# EasyEDA schematic SCH_Smart_Dispenser_2024-07-08.json
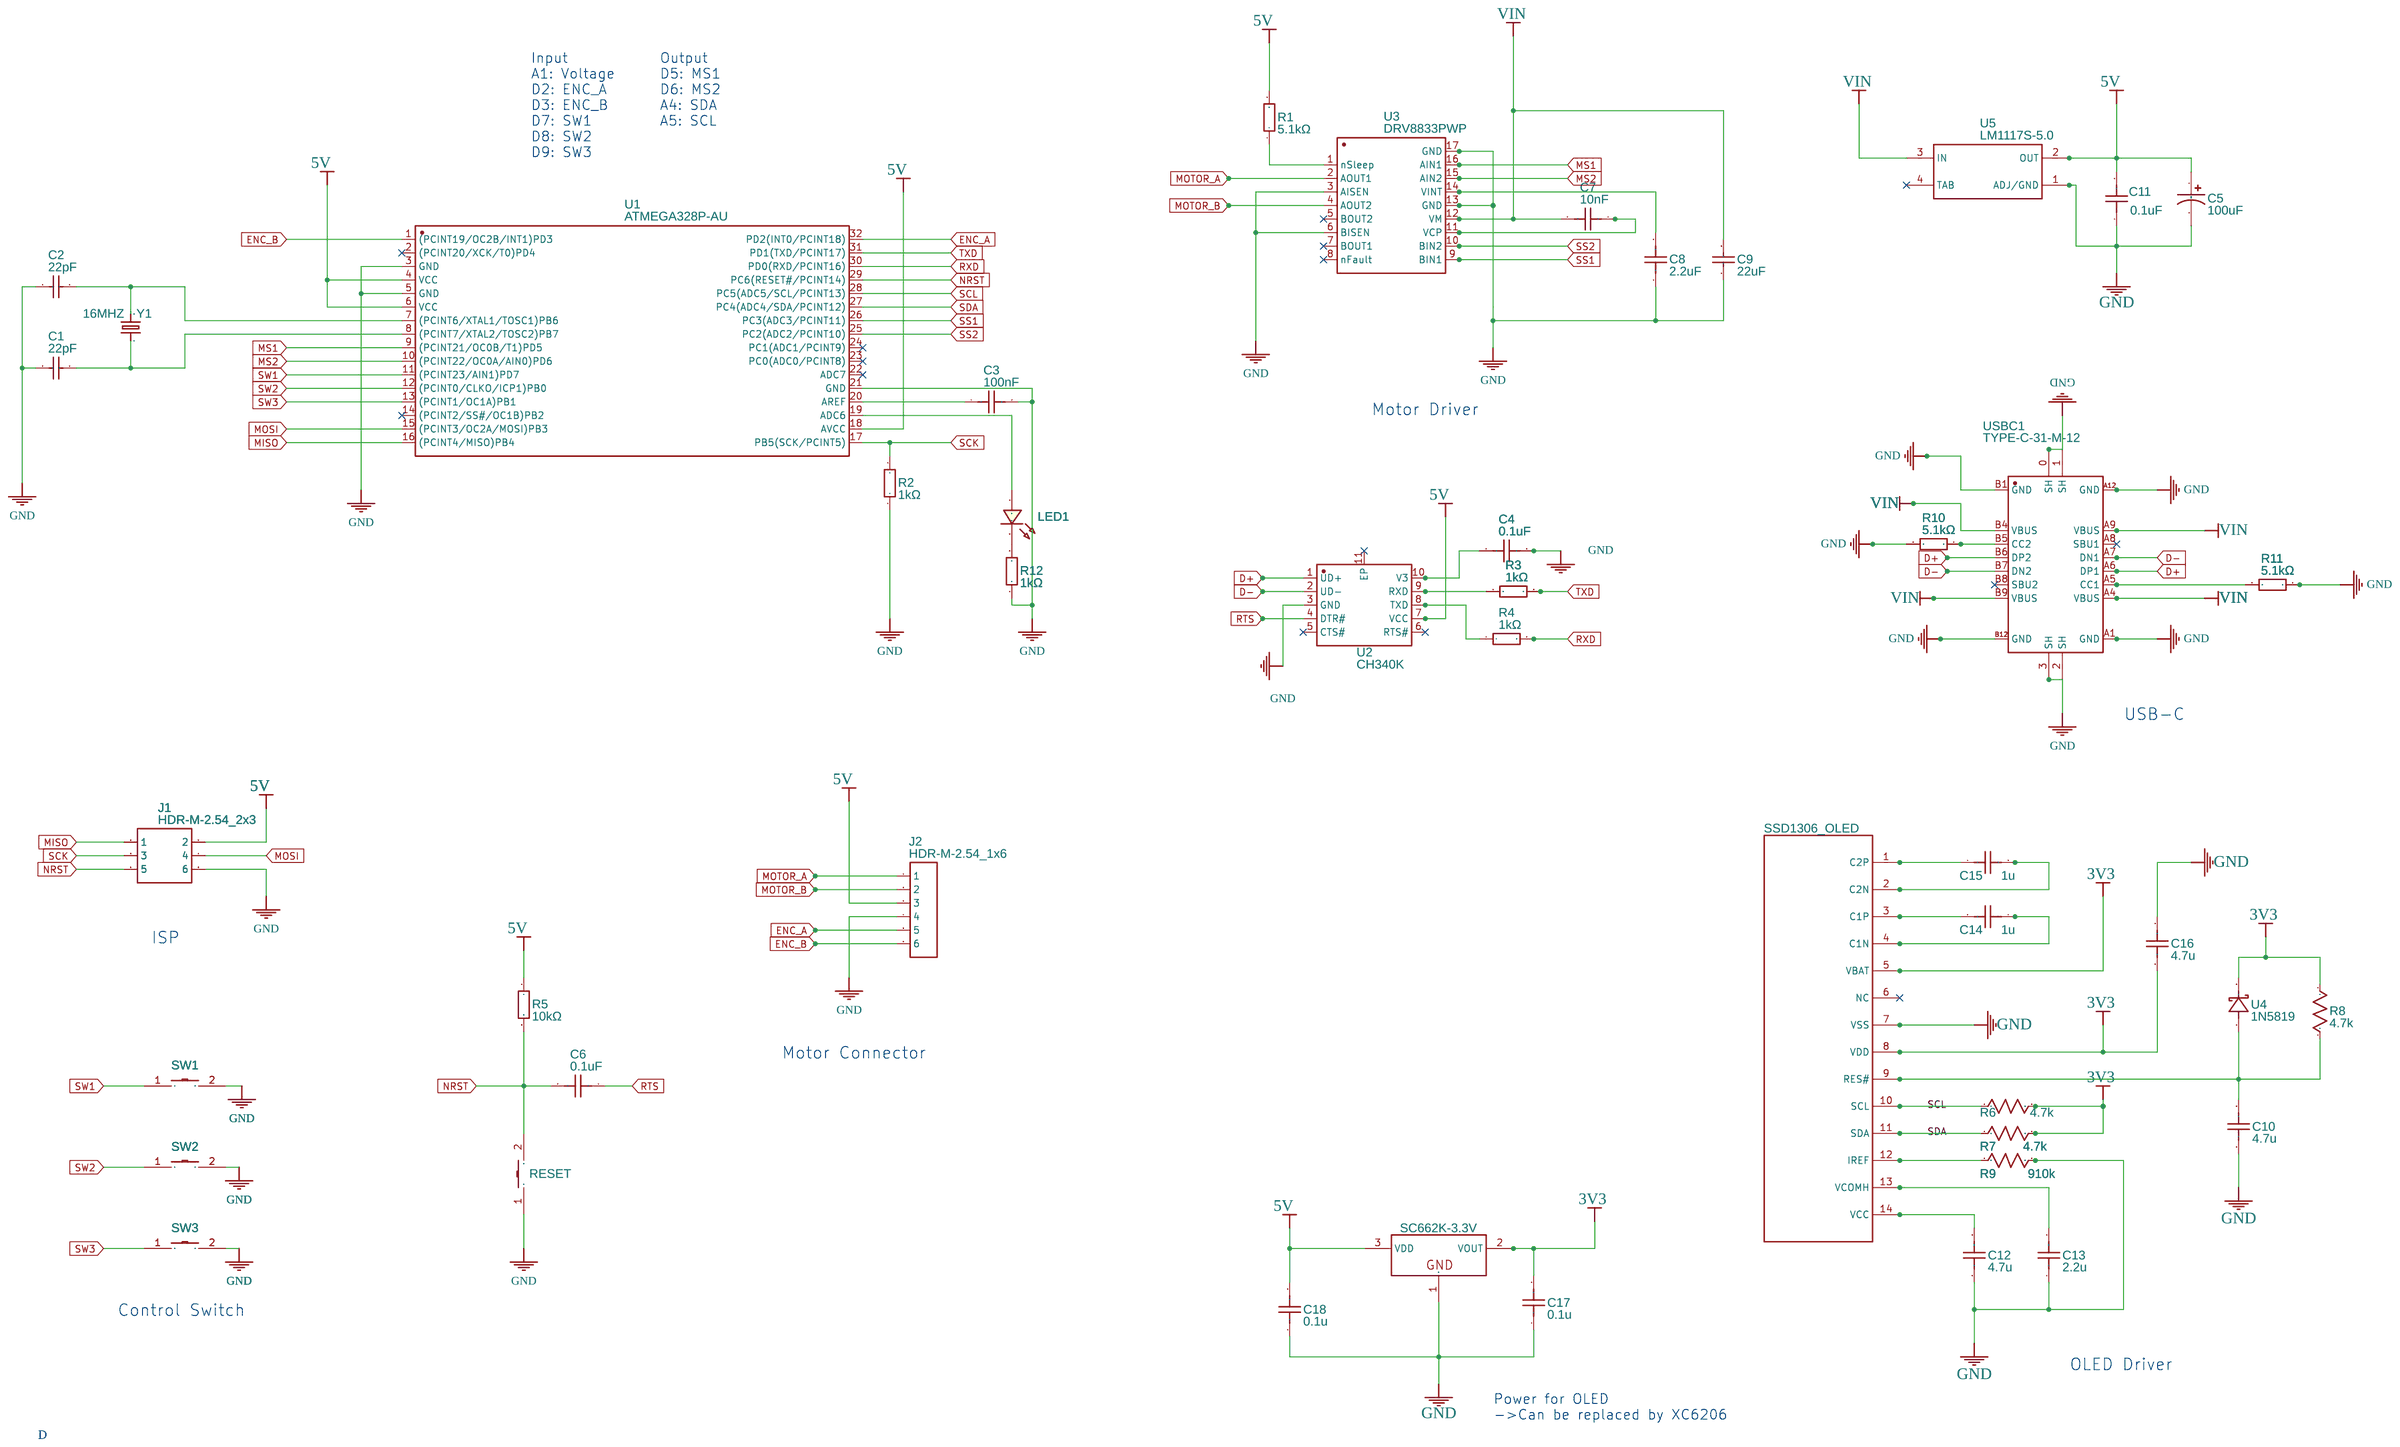
[diagram p0: schematic sheet]

## Parts
C1  22pF  [C0805]
C2  22pF  [C0805]
C3  100nF  [C0805]
C4  0.1uF  [C0805]
C5  100uF  [CAP-D6.3×H5.5]
C6  0.1uF  [C0805]
C7  10nF  [C0805]
C8  2.2uF  [C0805]
C9  22uF  [C0805]
C10  4.7u  [C0805]
C11  0.1uF  [C0805]
C12  4.7u  [C0805]
C13  2.2u  [C0805]
C14  1u  [C0805]
C15  1u  [C0805]
C16  4.7u  [C0805]
C17  0.1u  [C0805]
C18  0.1u  [C0805]
J1  HDR-M-2.54_2x3  [HDR-M-2.54_2X3]
J2  HDR-M-2.54_1x6  [HDR-M-2.54_1X6]
LDO1  SC662K-3.3V  [SOT-23-3_L2.9-W1.3-P1.90-LS2.4-BR]
LED1  LED-0603_R  [LED0603_RED]
R1  5.1kΩ  [R0805]
R2  1kΩ  [R0805]
R3  1kΩ  [R0805]
R4  1kΩ  [R0805]
R5  10kΩ  [R0805]
R6  4.7k  [R0805]
R7  4.7k  [R0805]
R8  4.7k  [R0805]
R9  910k  [R0805]
R10  5.1kΩ  [R0805]
R11  5.1kΩ  [R0805]
R12  1kΩ  [R0805]
RESET  TS-1101-C-W  [SW-SMD_L6.0-W3.3-LS8.0]
SW1  TS-1101-C-W  [SW-SMD_L6.0-W3.3-LS8.0]
SW2  TS-1101-C-W  [SW-SMD_L6.0-W3.3-LS8.0]
SW3  TS-1101-C-W  [SW-SMD_L6.0-W3.3-LS8.0]
U1  ATMEGA328P-AU  [TQFP-32_L7.0-W7.0-P0.80-LS9.0-BL]
U2  CH340K  [ESOP-10_L4.9-W3.9-P1.00-LS6.2-BL-EP]
U3  DRV8833PWP  [TSSOP-16_L5.0-W4.4-P0.65-LS6.4-BL-EP]
U4  1N5819  [SOD-123_L2.7-W1.6-LS3.7-FD]
U5  LM1117S-5.0  [SOT-223-3_L6.5-W3.4-P2.30-LS7.0-BR]
U6  SSD1306_OLED  [0.91"OLED_FOLD]
USBC1  TYPE-C-31-M-12  [USB-C_SMD-TYPE-C-31-M-12]
Y1  16MHZ  [X3-SMD-3.6X1.3X0.8MM]

## Library data of the parts
C1 C2 = CL21C220JBANNNC: Supplier: LCSC; Manufacturer: SAMSUNG(三星); Supplier Part: C1804; JLCPCB Part Class: Basic Part
C3 C4 C6 C7 C11 = C0805B104K500NT: Supplier: LCSC; Supplier Part: C476766; Manufacturer: TORCH(火炬); Contributor: LCSC; JLCPCB Part Class: Extended Part
C5 = CE_SMD_D6.3×H5.5_US: Contributor: LCEDA_Lib
C8 = CL21A226MAYNNNE: Supplier: LCSC; Supplier Part: C602037; Manufacturer: SAMSUNG(三星); Contributor: LCSC; JLCPCB Part Class: Extended Part
C9 = CL21C222JBFNNNE: Supplier: LCSC; Manufacturer: SAMSUNG(三星); Supplier Part: C28260; JLCPCB Part Class: Basic Part
C10 C12-C18 = C_0805_US: Contributor: LCEDA_Lib
J1 = HDR-M-2.54_2x3: Supplier Part: C65114; Supplier: LCSC; Contributor: LCEDA_Lib
J2 = HDR-M-2.54_1x6: Supplier Part: C190819; Supplier: LCSC; Contributor: LCEDA_Lib
LDO1 = SC662K-3.3V: Supplier: LCSC; Manufacturer: FM(富满); Supplier Part: C83932; JLCPCB Part Class: Extended Part; link: https://lcsc.com/eda_search?q=C83932&%26type=1&ref=editor
LED1 = LED-0603_R: Manufacturer: EVERLIGHT(台湾亿光); Manufacturer Part: 19-217/R6C-AL1M2VY/3T; Supplier Part: C72044; Supplier: LCSC; Contributor: LCEDA_01
R1 R5 = 0805W8F1002T5E: Supplier: LCSC; Manufacturer: UNI-ROYAL(厚声); Supplier Part: C17414; Resistance (Ohms): 10K; JLCPCB Part Class: Basic Part
R2-R4 R10-R12 = 0805W8F1001T5E: Supplier: LCSC; Manufacturer: UNI-ROYAL(厚声); Supplier Part: C17513; Resistance (Ohms): 1K; JLCPCB Part Class: Basic Part
R6-R9 = R_0805_US: Contributor: LCEDA_Lib
RESET SW1-SW3 = TS-1101-C-W: Supplier: LCSC; Supplier Part: C318938; Manufacturer: XKB Connectivity(中国星坤); Contributor: LCSC; JLCPCB Part Class: Extended Part
U1 = ATMEGA328P-AU: Supplier: LCSC; Manufacturer: MICROCHIP(美国微芯); Supplier Part: C14877; JLCPCB Part Class: Basic Part
U2 = CH340K: Supplier: LCSC; Supplier Part: C968586; Manufacturer: WCH(南京沁恒); Contributor: LCSC; JLCPCB Part Class: Extended Part
U3 = DRV8833PWP: Supplier: LCSC; Manufacturer: TI(德州仪器); Manufacturer Part: DRV8833PWPR; Supplier Part: C50506; JLCPCB Part Class: Extended Part
U4 = 1N5819W_C5451628: Supplier: LCSC; Supplier Part: C5451628; Manufacturer: HXY MOSFET(华轩阳电子); Manufacturer Part: 1N5819W; Contributor: lcsc; JLCPCB Part Class: Extended Part
U5 = LM1117S-5.0: Supplier: LCSC; Manufacturer: HTC; Supplier Part: C126028; JLCPCB Part Class: Extended Part
U6 = SSD1306_OLED: Contributor: pashiran
USBC1 = TYPE-C-31-M-12: Contributor: LCSC; Supplier: LCSC; Supplier Part: C165948; Manufacturer: 韩国韩荣; JLCPCB Part Class: Extended Part
Y1 = 16MHZ: SMD Crystal 8MHz -0.3%-150R; Supplier Part: 306010053; Supplier: SeeedStudio; Manufacturer Part: CSTCE16M00G55-RO; sourceId: A2s1dNLJt

## Nets
3V3: C16.2 C17.2 LDO1.2(VOUT) R6.2 R7.2 R8.1 U4.2(K) U6.5(VBAT) U6.8(VDD)
5V: C5.1 C11.2 C18.2 J1.2 J2.3 LDO1.3(VDD) R1.2 R5.1 U1.4(VCC) U1.6(VCC) U1.18(AVCC) U2.7(VCC) U5.2(OUT)
GND: C1.1 C2.1 C3.2 C4.2 C5.2 C8.1 C9.1 C10.1 C11.1 C12.1 C13.1 C16.1 C17.1 C18.1 J1.6 J2.4 LDO1.1(GND) R2.1 R9.2 R10.2 R11.1 R12.1 RESET.1 SW1.2 SW2.2 SW3.2 U1.3(GND) U1.5(GND) U1.21(GND) U2.3(GND) U3.3(AISEN) U3.6(BISEN) U3.13(GND) U3.17(GND) U5.1(ADJ/GND) U6.7(VSS) USBC1.0(SH) USBC1.1(SH) USBC1.2(SH) USBC1.3(SH) USBC1.A1(GND) USBC1.A12(GND) USBC1.B1(GND) USBC1.B12(GND)
VIN: C7.2 C9.2 U3.12(VM) U5.3(IN) USBC1.A4(VBUS) USBC1.A9(VBUS) USBC1.B4(VBUS) USBC1.B9(VBUS)
D+: U2.1(UD+) USBC1.A6(DP1) USBC1.B6(DP2)
D-: U2.2(UD-) USBC1.A7(DN1) USBC1.B7(DN2)
ENC_A: J2.5 U1.32(PD2(INT0/PCINT18))
ENC_B: J2.6 U1.1((PCINT19/OC2B/INT1)PD3)
MISO: J1.1 U1.16((PCINT4/MISO)PB4)
MOSI: J1.4 U1.15((PCINT3/OC2A/MOSI)PB3)
MOTOR_A: J2.1 U3.2(AOUT1)
MOTOR_B: J2.2 U3.4(AOUT2)
MS1: U1.9((PCINT21/OC0B/T1)PD5) U3.16(AIN1)
MS2: U1.10((PCINT22/OC0A/AIN0)PD6) U3.15(AIN2)
NRST: C6.2 J1.5 R5.2 RESET.2 U1.29(PC6(RESET#/PCINT14))
RTS: C6.1 U2.4(DTR#)
RXD: R4.2 U1.30(PD0(RXD/PCINT16))
SCK: J1.3 R2.2 U1.17(PB5(SCK/PCINT5))
SCL: R6.1 U1.28(PC5(ADC5/SCL/PCINT13)) U6.10(SCL)
SDA: R7.1 U1.27(PC4(ADC4/SDA/PCINT12)) U6.11(SDA)
SS1: U1.26(PC3(ADC3/PCINT11)) U3.9(BIN1)
SS2: U1.25(PC2(ADC2/PCINT10)) U3.10(BIN2)
SW1: SW1.1 U1.11((PCINT23/AIN1)PD7)
SW2: SW2.1 U1.12((PCINT0/CLKO/ICP1)PB0)
SW3: SW3.1 U1.13((PCINT1/OC1A)PB1)
TXD: R3.2 U1.31(PD1(TXD/PCINT17))
Net-(C1-2): C1.2 U1.8((PCINT7/XTAL2/TOSC2)PB7) Y1.1
Net-(C2-2): C2.2 U1.7((PCINT6/XTAL1/TOSC1)PB6) Y1.3
Net-(C3-1): C3.1 U1.20(AREF)
Net-(C4-1): C4.1 U2.10(V3)
Net-(C7-1): C7.1 U3.11(VCP)
Net-(C8-2): C8.2 U3.14(VINT)
Net-(C10-2): C10.2 R8.2 U4.1(A) U6.9(RES#)
Net-(C12-2): C12.2 U6.14(VCC)
Net-(C13-2): C13.2 U6.13(VCOMH)
Net-(C14-1): C14.1 U6.4(C1N)
Net-(C14-2): C14.2 U6.3(C1P)
Net-(C15-1): C15.1 U6.1(C2P)
Net-(C15-2): C15.2 U6.2(C2N)
Net-(LED1-1): LED1.1 U1.19(ADC6)
Net-(LED1-2): LED1.2 R12.2
Net-(R1-1): R1.1 U3.1(nSleep)
Net-(R3-1): R3.1 U2.9(RXD)
Net-(R4-1): R4.1 U2.8(TXD)
Net-(R9-1): R9.1 U6.12(IREF)
Net-(R10-1): R10.1 USBC1.B5(CC2)
Net-(R11-2): R11.2 USBC1.A5(CC1)

Not connected (* = marked no-connect by the designer): U1 2((PCINT20/XCK/T0)PD4)* 14((PCINT2/SS#/OC1B)PB2)* 22(ADC7)* 23(PC0(ADC0/PCINT8))* 24(PC1(ADC1/PCINT9))*; U2 5(CTS#)* 6(RTS#)* 11(EP)*; U3 5(BOUT2)* 7(BOUT1)* 8(nFault)*; U5 4(TAB)*; U6 6(NC)*; USBC1 A8(SBU1)* B8(SBU2)*

## Notes on the sheet
- Input
  A1: Voltage
  D2: ENC_A
  D3: ENC_B
  D7: SW1
  D8: SW2
  D9: SW3
- Output
  D5: MS1
  D6: MS2
  A4: SDA
  A5: SCL
- Motor Driver
- USB-C
- ISP
- Motor Connector
- Control Switch
- OLED Driver
- Power for OLED
  ->Can be replaced by XC6206
- D
